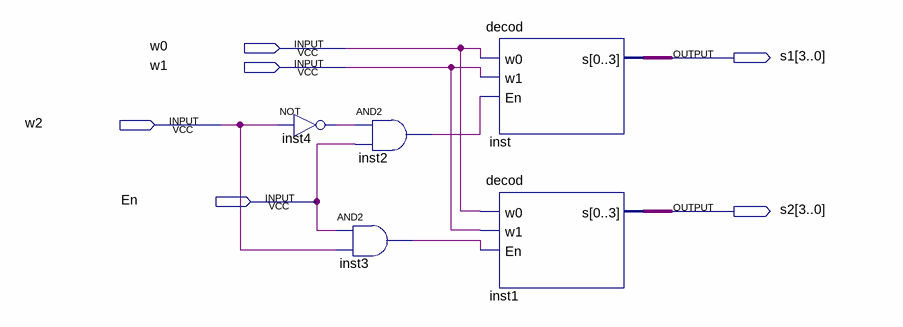
[diagram p0: schematic sheet]
// Quartus schematic decodModified.bdf as structural Verilog: 5 symbols, 6 pins
module decodModified (
  input  w0,
  input  w1,
  input  w2,
  input  En,
  output [3:0] s1,
  output [3:0] s2
);

  wire inst2_out, inst3_out, inst4_out;

  not inst4 (inst4_out, w2);
  and inst3 (inst3_out, En, w2);
  and inst2 (inst2_out, inst4_out, En);
  decod inst (.w0(w0), .w1(w1), .En(inst2_out), .s(s1));
  decod inst1 (.w0(w0), .w1(w1), .En(inst3_out), .s(s2));
endmodule
